# Altium schematic sheet MOSFET.SchDoc
size A4; SheetNumber: 3; SheetTotal: 3
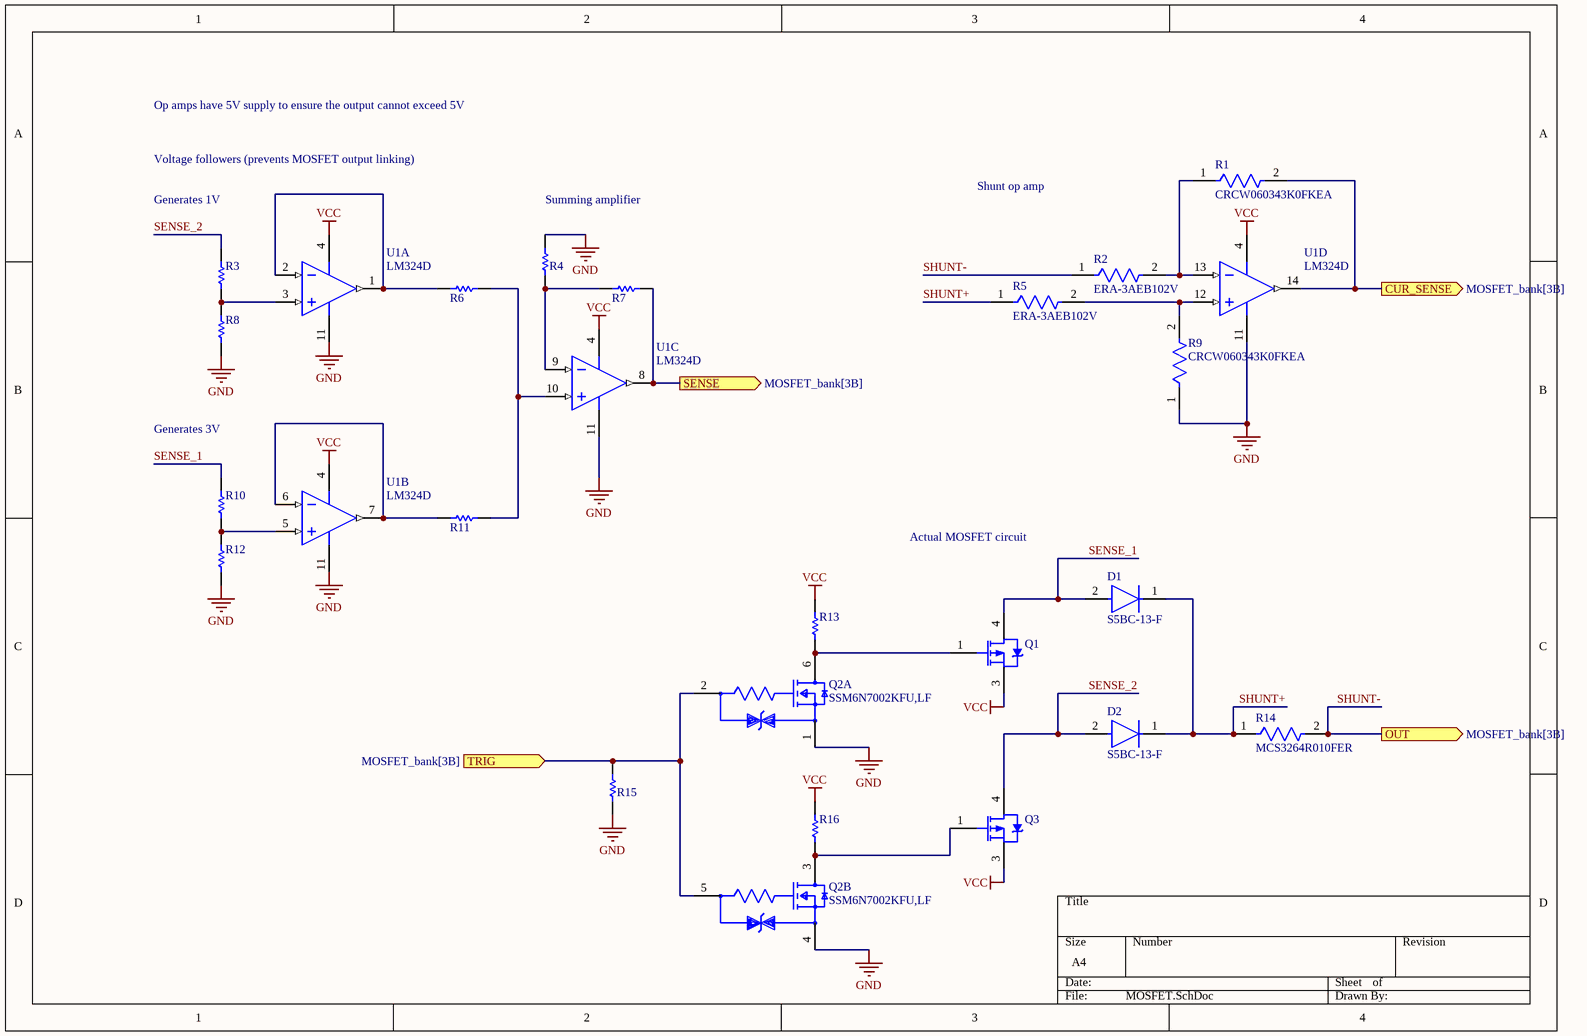
[diagram p0: MOSFET.SchDoc]

## Parts
D1  S5BC-13-F  [FP-SMC-MFG]
D2  S5BC-13-F  [FP-SMC-MFG]
Q1  NTD25P03LT4G  [ONSC-DPAK-3-369C-01_V]  (value not drawn)
Q2  SSM6N7002KFU,LF  [FP-SSOP6-P-0_65A-MFG]  (parts A,B of 2)
Q3  NTD25P03LT4G  [ONSC-DPAK-3-369C-01_V]  (value not drawn)
R1  CRCW060343K0FKEA  [FP-CRCW0603-e3-IPC_A]
R2  ERA-3AEB102V  [FP-ERA3A-IPC_C]
R3  ERJ3EKF1002V  [RESC1609X55X30LL15T15]  (value not drawn)
R4  ERJ3EKF1002V  [RESC1609X55X30LL15T15]  (value not drawn)
R5  ERA-3AEB102V  [FP-ERA3A-IPC_C]
R6  ERJ3EKF1002V  [RESC1609X55X30LL15T15]  (value not drawn)
R7  ERJ3EKF1002V  [RESC1609X55X30LL15T15]  (value not drawn)
R8  ERA-3AEB751V  [RESC1608X55X30ML20T20]  (value not drawn)
R9  CRCW060343K0FKEA  [FP-CRCW0603-e3-IPC_A]
R10  ERJ3EKF1002V  [RESC1609X55X30LL15T15]  (value not drawn)
R11  ERJ3EKF1002V  [RESC1609X55X30LL15T15]  (value not drawn)
R12  ERA3AEB242V  [RESC1608X55X30NL20T20]  (value not drawn)
R13  ERJ3EKF1002V  [RESC1609X55X30LL15T15]  (value not drawn)
R14  MCS3264R010FER  [FP-MCS3264-MFG]
R15  ERJ3EKF1002V  [RESC1609X55X30LL15T15]  (value not drawn)
R16  ERJ3EKF1002V  [RESC1609X55X30LL15T15]  (value not drawn)
U1  LM324D  [D0014A_L]  (parts A,B,C,D of 4)

## Ports
CUR_SENSE (out, see MOSFET_bank[3B]), OUT (out, see MOSFET_bank[3B]), SENSE (out, see MOSFET_bank[3B]), TRIG (in, see MOSFET_bank[3B])

## Nets
GND: Q2.1(Source1) Q2.4(Source2) R4.1 R8.1 R9.1 R12.1 R15.2 U1.11(GND)
VCC: Q1.3(S) Q3.3(S) R13.2 R16.2 U1.4(VCC)
CUR_SENSE: R1.2 U1.14(4OUT) ; port CUR_SENSE
SENSE: R7.1 U1.8(3OUT) ; port SENSE
SENSE_1: D1.2(A) Q1.4(D) R10.2
SENSE_2: D2.2(A) Q3.4(D) R3.2
SHUNT+: D1.1(C) D2.1(C) R5.1 R14.1
SHUNT-: R2.1 R14.2 ; port OUT
TRIG: Q2.2(Gate1) Q2.5(Gate2) R15.1 ; port TRIG
NetQ1_1: Q1.1(G) Q2.6(Drain1) R13.1
NetQ2_3: Q2.3(Drain2) Q3.1(G) R16.1
NetR1_1: R1.1 R2.2 U1.13(4IN-)
NetR3_1: R3.1 R8.2 U1.3(1IN+)
NetR4_2: R4.2 R7.2 U1.9(3IN-)
NetR5_2: R5.2 R9.2 U1.12(4IN+)
NetR6_1: R6.1 R11.1 U1.10(3IN+)
NetR6_2: R6.2 U1.1(1OUT) U1.2(1IN-)
NetR10_1: R10.1 R12.2 U1.5(2IN+)
NetR11_2: R11.2 U1.6(2IN-) U1.7(2OUT)

## Notes on the sheet
- Op amps have 5V supply to ensure the output cannot exceed 5V
- Voltage followers (prevents MOSFET output linking)
- Generates 1V
- (near R4) Summing amplifier
- Shunt op amp
- Generates 3V
- Actual MOSFET circuit

## Library data of the parts
D1 D2 = CMP-2000-07025-2: DIODE GEN PURP 100V 5A SMC; Manufacturer: Diodes Inc.; Peak Reverse Current: 10uA; Max Junction Temp: +150°C; Max Surge Forward Current: 100A; Value: 40pF; Standoff Height: 0.1mm; Octopart: https://octopart.com/s5bc-13-f-diodes+inc.-333396; Category: Diode; Manufacturer Part Number: S5BC-13-F; RoHS: TRUE; Footprint Url: https://www.diodes.com/assets/Package-Files/SMC.pdf; Device Class L1: Discrete Semiconductors; Temperature Range Low: -65°C; Lead Free: Yes; ComponentLink2URL: https://www.diodes.com/assets/Datasheets/ds16007.pdf; Package: SMC; Max Repetitive Reverse Voltage: 100V; Device Class L3: Rectifier Diodes; Automotive: No; Forward Current: 5A; Temperature: -65°C to +150°C; Digikey Description: DIODE GEN PURP 100V 5A SMC; Reverse Voltage: 100V; Capacitance: 40pF; Mouser Description: Rectifiers 100V 5A; ComponentLink2Description: Datasheet; Device Class L2: Diodes; Temperature Range High: +150°C; Height: 2.5mm
Q1 Q3 = CMP-1058-00409-1: Power MOSFET, -25 A, -30 V, Logic Level P-Channel, 3-Pin DPAK, Pb-Free, Tape and Reel; Manufacturer: On Semiconductor; Coss Typ (pF): 290; Crss Typ (pF): 105; V(BR)DSS Min (V): 30; VGS Max (V): 15; PD Max (W): 75; Ciss Typ (pF): 900; ID Max (A): 25; Qrr Typ (nC): 35; Configuration: Single; Channel Polarity: P Channel; VGS(th) Max (V): 2; Mounting Technology: Surface Mount; ComponentLink2Description: Datasheet; ComponentLink3URL: http://www.onsemi.cn/pub_link/Collateral/369C.PDF; ComponentLink1Description: Manufacturer URL; ComponentLink3Description: Package Specification; Packing: Tape and Reel; DatasheetVersion: Rev. 4; PackageDescription: 3-Pin Flange Mount, Body 6.54 x 6.095 mm, Pitch 2.29 mm; ComponentLink2URL: http://www.onsemi.cn/pub_link/Collateral/NTD25P03L-D.PDF; PackageReference: DPAK-3-369C-01; Package Type: DPAK-3; PackageVersion: Rev. E, 02/2014; ComponentLink1URL: http://www.onsemi.com/; RoHS: Pb-Free; PartNumber: NTD25P03LT4G
Q2 = CMP-35916-000009-1: MOSFET 2N-CH 60V 0.3A; Input Capacitance: 40pF; Continuous Drain Current (ID): 300mA; Max Power Dissipation: 285mW; FET Type: 2 N-Channel; Rds On Max: 1.5R; Mount: Surface Mount; Drain to Source Voltage (Vdss): 60V; Packaging: Tape and Reel
R1 R9 = CMP-2000-03352-2: RES Thick Film, 43kΩ, 1%, 0.1W, 100ppm/°C, 0603; Voltage Rating: 75V; Power Rating: 100mW; Resistance: 43kR; Height: 0.45mm; Contact Plating: Tin; Depth: 0.85mm; Case Code (Metric): 1608; Min Operating Temperature: -55°C; Length: 1.55mm; Voltage Rating (DC): 75V; Tolerance: 1%; Case Code (Imperial): 0603; Features: Automotive AEC-Q200; Number of Pins: 2; Lead Free: Lead Free; Number of Terminations: 2; Temperature Coefficient: 100ppm/°C; Max Power Dissipation: 100mW; Package Quantity: 10; Weight: 7.1E-05oz; Military Standard: Not; Termination: SMD/SMT; Max Operating Temperature: 155°C; Radiation Hardening: No; Width: 0.033inch; Mount: Surface Mount; Composition: Thick Film; Case/Package: 0603; Packaging: Tape and Reel
R2 R5 = CMP-2000-00873-2: RES SMD 1K OHM 0.1% 1/10W 0603; Temperature Coefficient: 25ppm/°C; Voltage Rating: 75V; Max Power Dissipation: 100mW; Resistance: 1kR; Technology: METAL FILM; Number of Pins: 2; Packaging: Tape and Reel; Case Code (Imperial): 0603; Case Code (Metric): 1608; Min Operating Temperature: -55°C; REACH SVHC: No SVHC; Length: 1.6mm; Termination: SMD/SMT; Depth: 0.8mm; Resistance Tolerance: 0.1%; Number of Terminations: 2; Width: 0.8mm; Military Standard: Not; Tolerance: 0.1%; Package Quantity: 5000; Contact Plating: Tin; Height: 0.45mm; Construction: Rectangular; Case/Package: 0603; Max Operating Temperature: 155°C; Resistor Type: Thin Film; Series: ERA-3A; Size Code: 0603; RoHS Compliant: Yes; Mount: Surface Mount; Radiation Hardening: No; Power Rating: 100mW
R3 R4 R6 R7 R10 R11 R13 R15 R16 = CMP-1012-00623-3: Chip Resistor, 10 KOhm, +/- 1%, 0.1 W, -55 to 155 degC, 0603 (1608 Metric), RoHS, Tape and Reel; Manufacturer: Panasonic; Voltage Rating: 75V; Case\/Package: 0603; Power Rating: 100mW; Resistance: 10KOhm; Temperature Coefficient: 100ppm\/degreesC; Number of Pins: 2; Package Reference: 603; Depth: 0.8mm; Mount: SurfaceMount; Package Description: 2-Pin Surface Mount Device, Body 1.6 x 0.85 mm; Datasheet Version: 02/2017; Length: 1.6mm; Lead Free: LeadFree; Height: 0.45mm; Number of Terminations: 2; Max Power Dissipation: 100mW; Min Operating Temperature: -55degC; Datasheet URL: https://industrial.panasonic.com/cdbs/www-data/pdf/RDA0000/AOA0000C304.pdf; Termination: SMD/SMT; Case Code (Metric): 1608; Case Code (Imperial): 0603; Tolerance: 1%; Max Operating Temperature: 155degC; RoHSCompliant: true; Voltage Rating (DC): 75V; Radiation Hardening: No; Packaging: TapeandReel; Composition: ThickFilm; Mounting Technology: SurfaceMount; Manufacturer URL: http://www.panasonic.com/; Width: 0.031inch; REACH SVHC: NoSVHC; Contact Plating: Tin; Military Standard: Not; Package Quantity: 1
R8 = CMP-2000-00122-1: Manufacturer: Panasonic; Part Number: ERA-3AEB751V
R12 = CMP-2000-00965-1: Manufacturer: Panasonic; Part Number: ERA3AEB242V
R14 = CMP-33361-000012-1: RES SMD 10 MOHM 1% 2W 3264; Temperature Coefficient: 50ppm/°C; Resistance: 10mR; Voltage Rating: 220mV; Case/Package: 2512; Military Standard: Not; Max Operating Temperature: 150°C; Height: 0.024inch; Package Quantity: 1; Case Code (Imperial): 2512; Number of Terminations: 2; Features: Flame Retardant Coating; Width: 0.126inch; Tolerance: 1%; Composition: Metal Element; Number of Pins: 2; Packaging: Tape and Reel; Depth: 3.2mm; Termination: SMD/SMT; Min Operating Temperature: -55°C; Power Rating: 2W; Case Code (Metric): 6432; Max Power Dissipation: 2W; Mount: Surface Mount; Length: 6.4mm
U1 = CMP-2000-06547-1: Quadruple Operational Amplifier, 0.5 V/us, 1.2 MHz, 3 to 32 V, 0 to 70 degC, 14-Pin SOIC (D), Green (RoHS & no Sb/Br), Tube; Manufacturer: Texas Instruments; Unity Gain Bandwidth Product: 1.2MHz; Input Offset Voltage: 7mV; Dual Supply Voltage (Max): ±16V; Single Supply Voltage (Min): 3V; Single Supply Voltage (Max): 32V; Voltage Gain in dB: 100dB; Power Supply Requirement: Single/Dual; Input Bias Current: 250nA; Dual Supply Voltage (Min): ±1.5V; Single Supply Voltage (Typ): 5/9/12/15/18/24/28V; Dual Supply Voltage (Typ): ±3/±5/±9/±12/±15V; Number of  Elements: 4; Common Mode Rejection Ratio: 65dB; Datasheet Version: Rev. W, 03/2015; Technology: Bipolar; Shut Down Feature: No; Package Reference: D0014A; Type: GeneralPurposeAmplifier; Pin Count: 14; Package Type: SOIC; Rail/Rail I/O Type: No; Manufacturer URL: http://www.ti.com/; Package Description: 14-Pin Small Outline Integrated Circuit, Body 8.65 x 3.9 mm, Pitch 1.27 mm; Operating Temperature Classification: Commercial; Datasheet URL: http://www.ti.com/lit/ds/symlink/lm324.pdf; Slew Rate: 0.5V/us; Package URL: http://www.ti.com/lit/ml/mpds177g/mpds177g.pdf; Mounting: SurfaceMount; Packaging: Rail/Tube; Mounting Technology: SurfaceMount; Operating Temp Range: 0Cto70C